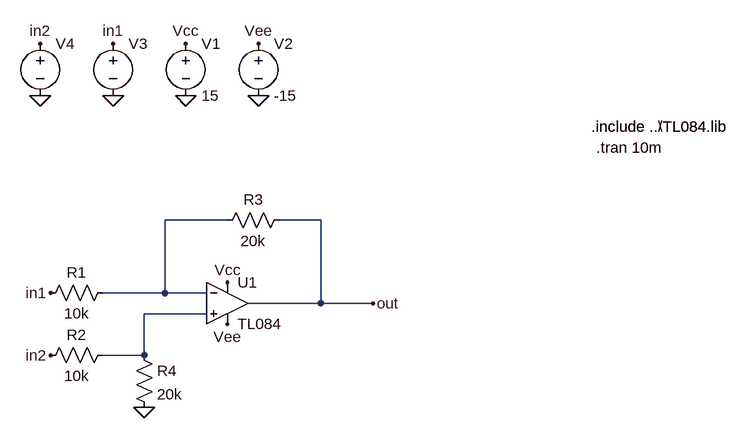
[diagram p0: schematic differentialAmplifier_LOCAL_891.asc]
differentialAmplifier_LOCAL_891.asc, the LTspice schematic file:
Version 4
SHEET 1 880 680
WIRE -48 336 -144 336
WIRE 96 336 32 336
WIRE -144 448 -144 336
WIRE -144 448 -240 448
WIRE -80 448 -144 448
WIRE 96 464 96 336
WIRE 96 464 -16 464
WIRE 176 464 96 464
WIRE -80 480 -176 480
WIRE -176 544 -176 480
WIRE -176 544 -240 544
FLAG -48 432 Vcc
FLAG -48 496 Vee
FLAG -320 448 in1
FLAG -320 544 in2
FLAG 176 464 out
FLAG -112 144 0
FLAG 0 144 0
FLAG -112 64 Vcc
FLAG 0 64 Vee
FLAG -224 144 0
FLAG -224 64 in1
FLAG -336 144 0
FLAG -336 64 in2
FLAG -176 624 0
SYMBOL Opamps\\opamp2 -48 400 R0
SYMATTR InstName U1
SYMATTR Value TL084
SYMBOL res -224 432 R90
WINDOW 0 0 56 VBottom 2
WINDOW 3 32 56 VTop 2
SYMATTR InstName R1
SYMATTR Value 10k
SYMBOL res -224 528 R90
WINDOW 0 0 56 VBottom 2
WINDOW 3 32 56 VTop 2
<<<<<<< HEAD
SYMATTR InstName R3
=======
SYMATTR InstName R2
>>>>>>> 3a136eb410fee3b3ada629bc093626d6e0446b7d
SYMATTR Value 10k
SYMBOL res 48 320 R90
WINDOW 0 0 56 VBottom 2
WINDOW 3 32 56 VTop 2
SYMATTR InstName R3
SYMATTR Value 20k
SYMBOL voltage -112 48 R0
WINDOW 123 0 0 Left 0
WINDOW 39 0 0 Left 0
SYMATTR InstName V1
SYMATTR Value 15
SYMBOL voltage 0 48 R0
WINDOW 123 0 0 Left 0
WINDOW 39 0 0 Left 0
SYMATTR InstName V2
SYMATTR Value -15
SYMBOL voltage -224 48 R0
WINDOW 3 24 96 Invisible 2
WINDOW 123 0 0 Left 0
WINDOW 39 0 0 Left 0
SYMATTR Value PULSE(-15 15 0.6m 0.01m 0.01m 1m 2m)
SYMATTR InstName V3
SYMBOL voltage -336 48 R0
WINDOW 3 24 96 Invisible 2
WINDOW 123 0 0 Left 0
WINDOW 39 0 0 Left 0
SYMATTR Value PULSE(-15 15 0 0.01m 0.01m 1m 2m)
SYMATTR InstName V4
SYMBOL res -192 528 R0
SYMATTR InstName R4
SYMATTR Value 20k
TEXT 520 224 Left 2 !.tran 10m
<<<<<<< HEAD
TEXT 512 192 Left 2 !.include ..\\TL084.lib
=======
TEXT 512 192 Left 2 !.include ../TL084.lib
>>>>>>> 3a136eb410fee3b3ada629bc093626d6e0446b7d

The netlist it stands for:
* differentialAmplifier_LOCAL_891.asc
XU1 N002 N001 Vcc Vee out TL084  ; pins In+ In- V+ V- OUT
R1 N001 in1 10k
R2 N002 in2 10k
R3 out N001 20k
V1 Vcc 0 15
V2 Vee 0 -15
V3 in1 0 PULSE(-15 15 0.6m 0.01m 0.01m 1m 2m)
V4 in2 0 PULSE(-15 15 0 0.01m 0.01m 1m 2m)
R4 N002 0 20k
.tran 10m
.include ..\TL084.lib
.include ../TL084.lib
.backanno
.end